# Altium schematic sheet Port.SchDoc
size A4; SheetNumber: 6; SheetTotal: 7
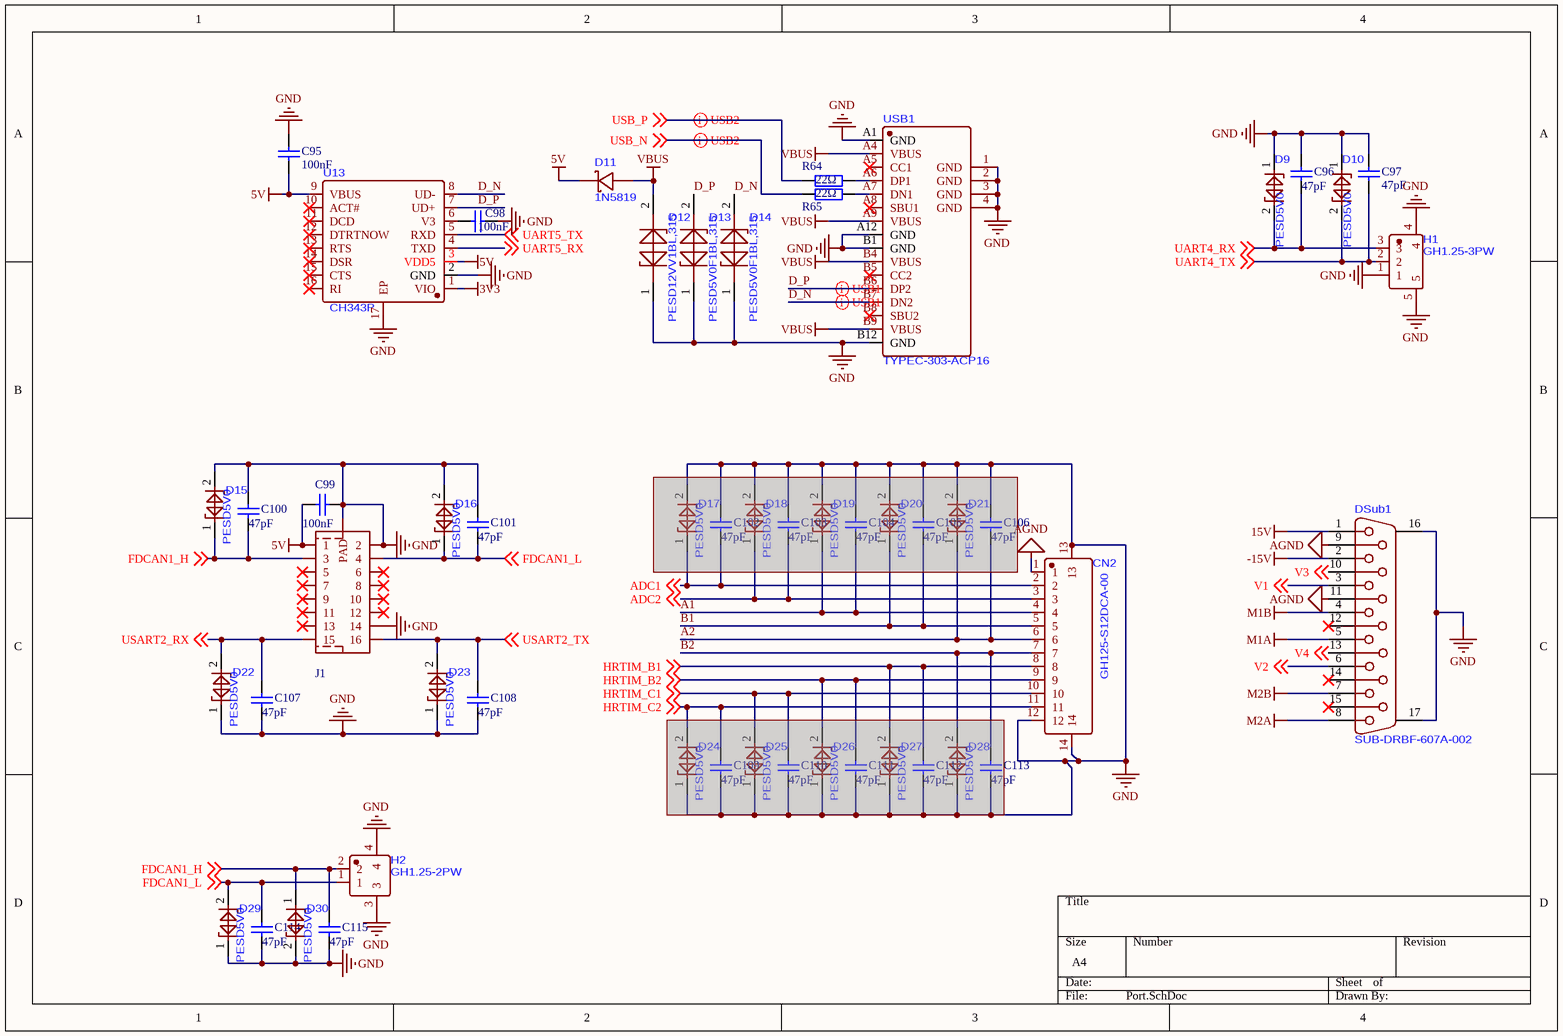
[diagram p0: Port.SchDoc]

## Parts
C95  100nF  [0402_C]
C96  47pF  [0402_C]
C97  47pF  [0402_C]
C98  100nF  [0402_C]
C99  100nF  [0402_C]
C100  47pF  [0402_C]
C101  47pF  [0402_C]
C102  47pF  [0402_C]  (masked out: inside a compile mask, not in the netlist)
C103  47pF  [0402_C]  (masked out: inside a compile mask, not in the netlist)
C104  47pF  [0402_C]  (masked out: inside a compile mask, not in the netlist)
C105  47pF  [0402_C]  (masked out: inside a compile mask, not in the netlist)
C106  47pF  [0402_C]  (masked out: inside a compile mask, not in the netlist)
C107  47pF  [0402_C]
C108  47pF  [0402_C]
C109  47pF  [0402_C]  (masked out: inside a compile mask, not in the netlist)
C110  47pF  [0402_C]  (masked out: inside a compile mask, not in the netlist)
C111  47pF  [0402_C]  (masked out: inside a compile mask, not in the netlist)
C112  47pF  [0402_C]  (masked out: inside a compile mask, not in the netlist)
C113  47pF  [0402_C]  (masked out: inside a compile mask, not in the netlist)
C114  47pF  [0402_C]
C115  47pF  [0402_C]
CN2  GH125-S12DCA-00  [CONN-SMD_12P-P1.25_GH125-S12DCA-00]
D9  PESD5V0  [SOD-882_L1.0-W0.6-BI]
D10  PESD5V0  [SOD-882_L1.0-W0.6-BI]
D11  1N5819  [DO-214AC_L4.3-W2.7-LS5.3-RD]
D12  PESD12VV1BL,315  [SOD-882_L1.0-W0.6-BI]
D13  PESD5V0F1BL,315  [SOD-882_L1.0-W0.6-BI]
D14  PESD5V0F1BL,315  [SOD-882_L1.0-W0.6-BI]
D15  PESD5V0  [SOD-882_L1.0-W0.6-BI]
D16  PESD5V0  [SOD-882_L1.0-W0.6-BI]
D17  PESD5V0  [SOD-882_L1.0-W0.6-BI]  (masked out: inside a compile mask, not in the netlist)
D18  PESD5V0  [SOD-882_L1.0-W0.6-BI]  (masked out: inside a compile mask, not in the netlist)
D19  PESD5V0  [SOD-882_L1.0-W0.6-BI]  (masked out: inside a compile mask, not in the netlist)
D20  PESD5V0  [SOD-882_L1.0-W0.6-BI]  (masked out: inside a compile mask, not in the netlist)
D21  PESD5V0  [SOD-882_L1.0-W0.6-BI]  (masked out: inside a compile mask, not in the netlist)
D22  PESD5V0  [SOD-882_L1.0-W0.6-BI]
D23  PESD5V0  [SOD-882_L1.0-W0.6-BI]
D24  PESD5V0  [SOD-882_L1.0-W0.6-BI]  (masked out: inside a compile mask, not in the netlist)
D25  PESD5V0  [SOD-882_L1.0-W0.6-BI]  (masked out: inside a compile mask, not in the netlist)
D26  PESD5V0  [SOD-882_L1.0-W0.6-BI]  (masked out: inside a compile mask, not in the netlist)
D27  PESD5V0  [SOD-882_L1.0-W0.6-BI]  (masked out: inside a compile mask, not in the netlist)
D28  PESD5V0  [SOD-882_L1.0-W0.6-BI]  (masked out: inside a compile mask, not in the netlist)
D29  PESD5V0  [SOD-882_L1.0-W0.6-BI]
D30  PESD5V0  [SOD-882_L1.0-W0.6-BI]
DSub1  SUB-DRBF-607A-002  [DSUB-TH_FDB1502-F0DB300K6KA]
H1  GH1.25-3PW  [CONN-SMD_GH1.25-3P]
H2  GH1.25-2PW  [CONN-TH_2P-P1.25_XUNPU_WAFER-GH1.25-2PLB]
J1  2*8P MTI630  [2*8P MTI630]  (value not drawn)
R64  22Ω  [0402_R]
R65  22Ω  [0402_R]
U13  CH343P  [TQFN-16_L3.0-W3.0-P0.50-BL-EP1.7]
USB1  TYPEC-303-ACP16  [USB-C-SMD_TYPEC-303-ACP16]

## Nets
3V3: U13.1(VIO)
5V: C95.2 C99.1 D11.1(C) J1.1 U13.3(VDD5) U13.9(VBUS)
15V: DSub1.1
-15V: DSub1.2
AGND: CN2.1 DSub1.9 DSub1.11
GND: C95.1 C96.2 C97.2 C98.1 C99.2 C100.2 C101.2 C107.1 C108.1 C114.1 C115.1 CN2.12 CN2.13 CN2.14 D9.1 D10.1 D12.1 D13.1 D14.1 D15.2 D16.2 D22.1 D23.1 D29.1 D30.2 DSub1.16(MH2) DSub1.17(MH1) H1.1 H1.4 H1.5 H2.3 H2.4 J1.2 J1.14 J1.17(PAD) U13.2(GND) U13.17(EP) USB1.1(GND) USB1.2(GND) USB1.3(GND) USB1.4(GND) USB1.A1(GND) USB1.A12(GND) USB1.B1(GND) USB1.B12(GND)
M1A: DSub1.5
M1B: DSub1.4
M2A: DSub1.8
M2B: DSub1.7
VBUS: D11.2(A) D12.2 USB1.A4(VBUS) USB1.A9(VBUS) USB1.B4(VBUS) USB1.B9(VBUS)
A1: CN2.4
A2: CN2.6
ADC1: CN2.2 ; off-sheet ADC1
ADC2: CN2.3 ; off-sheet ADC2
B1: CN2.5
B2: CN2.7
D_N: D14.2 U13.8(UD-) USB1.B7(DN2)
D_P: D13.2 U13.7(UD+) USB1.B6(DP2)
FDCAN1_H: C100.1 C115.2 D15.1 D30.1 H2.2 J1.3 ; off-sheet FDCAN1_H
FDCAN1_L: C101.1 C114.2 D16.1 D29.2 H2.1 J1.4 ; off-sheet FDCAN1_L
HRTIM_B1: CN2.8 ; off-sheet HRTIM_B1
HRTIM_B2: CN2.9 ; off-sheet HRTIM_B2
HRTIM_C1: CN2.10 ; off-sheet HRTIM_C1
HRTIM_C2: CN2.11 ; off-sheet HRTIM_C2
UART4_RX: C96.1 D9.2 H1.3 ; off-sheet UART4_RX
UART4_TX: C97.1 D10.2 H1.2 ; off-sheet UART4_TX
UART5_RX: U13.4(TXD) ; off-sheet UART5_RX
UART5_TX: U13.5(RXD) ; off-sheet UART5_TX
USART2_RX: C107.2 D22.2 J1.15 ; off-sheet USART2_RX
USART2_TX: C108.2 D23.2 J1.16 ; off-sheet USART2_TX
USB_N: R65.1 ; off-sheet USB_N
USB_P: R64.1 ; off-sheet USB_P
V1: DSub1.3 ; off-sheet V1
V2: DSub1.6 ; off-sheet V2
V3: DSub1.10 ; off-sheet V3
V4: DSub1.13 ; off-sheet V4
NetC98_2: C98.2 U13.6(V3)
NetR64_2: R64.2 USB1.A6(DP1)
NetR65_2: R65.2 USB1.A7(DN1)

Not connected (* = marked no-connect by the designer): DSub1 12* 14* 15*; J1 5* 6* 7* 8* 9* 10* 11* 12* 13*; U13 10(ACT#)* 11(DCD)* 12(DTRTNOW)* 13(RTS)* 14(DSR)* 15(CTS)* 16(RI)*; USB1 A5(CC1)* A8(SBU1)* B5(CC2)* B8(SBU2)*

## Layout directives
differential pair: D_N, D_P, USB_N, USB_P

## Library data of the parts
C95 C98 C99 = 0402 100nF (104) 10% 16V: 贴片电容; ComponentLink1Description: 供应商链接; ComponentLink1URL: http://www.szlcsc.com/product/details_1877.html; Package: 0402; Supplier: LC; SuppliersPartNumber: C1525
C96 C97 C100-C115 = 0402 47pF (470) 5% 50V: 贴片电容; ComponentLink1Description: 供应商链接; ComponentLink1URL: http://www.szlcsc.com/product/details_1919.html; Package: 0402; Supplier: LC; SuppliersPartNumber: C1567
D9 D10 D12 D15-D30 = PESD5V0F1BL,315
D11 = 1N5819(SS14)
R64 R65 = 0402 120Ω (1200) 1%: 贴片电阻; ComponentLink1Description: 供应商链接; ComponentLink1URL: http://www.szlcsc.com/product/details_25822.html; Package: 0402; Supplier: LC; SuppliersPartNumber: C25079